# EAGLE schematic CAN shield rev1 (EAGLE 8.1.0)
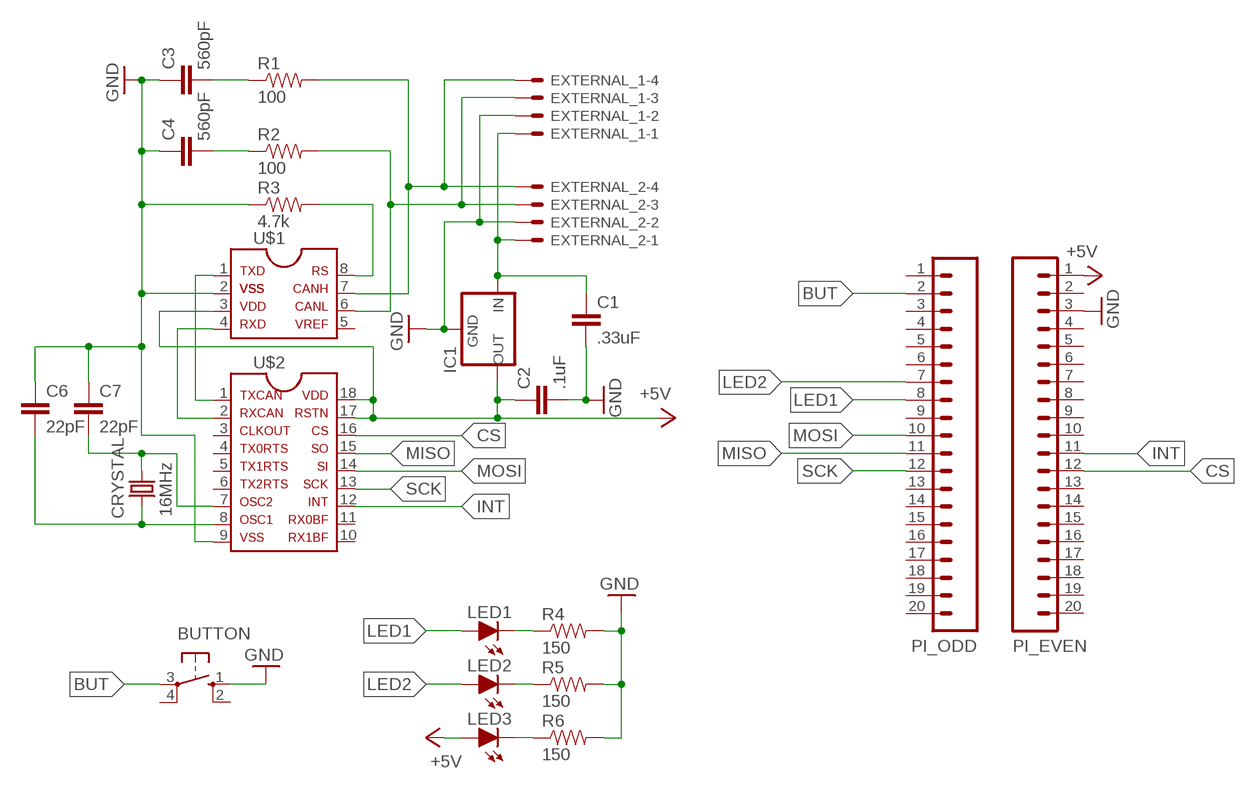
[diagram p0: schematic, sheet 1]

## Parts
BUTTON  BTN_10-XX  [B3F-10XX]
C1  .33uF  CAP0805  [0805]
C2  .1uF  CAP0805  [0805]
C3  560pF  CAP0805  [0805]
C4  560pF  CAP0805  [0805]
C6  22pF  CAP0805  [0805]
C7  22pF  CAP0805  [0805]
CRYSTAL  16MHz  CRYSTALSMD  [HC49UP]
EXTERNAL_1  MINIFIT_5566-4  [MINIFIT_5566-4]
EXTERNAL_2  MINIFIT_5566-4  [MINIFIT_5566-4]
IC1  5VREG_L7805_HOR  [TO-220-H]
LED1  LED-0805  [LED-805]
LED2  LED-0805  [LED-805]
LED3  LED-0805  [LED-805]
PI_EVEN  M20  [1X20]
PI_ODD  M20  [1X20]
R1  100  RESISTOR0805-RES  [0805]
R2  100  RESISTOR0805-RES  [0805]
R3  4.7k  RESISTOR0805-RES  [0805]
R4  150  RESISTOR0805-RES  [0805]
R5  150  RESISTOR0805-RES  [0805]
R6  150  RESISTOR0805-RES  [0805]
U$1  MCP2551  [SOIC-08]
U$2  MCP2515SMD  [SOIC-18W]

## Nets
+5V: C2.1 IC1.3(OUT) LED3.A PI_EVEN.1 U$1.3 U$2.17 U$2.18
BUT: BUTTON.3(P) PI_ODD.2
CAN-H: EXTERNAL_1.4 EXTERNAL_2.4 R1.2 U$1.7
CAN-L: EXTERNAL_1.3 EXTERNAL_2.3 R2.2 U$1.6
CS: PI_EVEN.12 U$2.16
GND: BUTTON.1(S) C1.2 C2.2 C3.1 C4.1 C6.1 C7.1 EXTERNAL_1.2 EXTERNAL_2.2 IC1.2(GND) PI_EVEN.3 R3.1 R4.2 R5.2 R6.2 U$1.2 U$2.9
INT: PI_EVEN.11 U$2.12
LED1: LED1.A PI_ODD.8
LED2: LED2.A PI_ODD.7
MISO: PI_ODD.11 U$2.15
MOSI: PI_ODD.10 U$2.14
N$1: LED1.C R4.1
N$2: LED2.C R5.1
N$5: C1.1 EXTERNAL_1.1 EXTERNAL_2.1 IC1.1(IN)
N$7: LED3.C R6.1
N$11: C6.2 CRYSTAL.2 U$2.8
N$12: U$1.1 U$2.1
N$13: U$1.4 U$2.2
N$14: C3.2 R1.1
N$15: C7.2 CRYSTAL.1 U$2.7
N$16: R3.2 U$1.8
N$17: C4.2 R2.1
SCK: PI_ODD.12 U$2.13
Unconnected: BUTTON.2(S1) BUTTON.4(P1) PI_EVEN.2 PI_EVEN.4 PI_EVEN.5 PI_EVEN.6 PI_EVEN.7 PI_EVEN.8 PI_EVEN.9 PI_EVEN.10 PI_EVEN.13 PI_EVEN.14 PI_EVEN.15 PI_EVEN.16 PI_EVEN.17 PI_EVEN.18 PI_EVEN.19 PI_EVEN.20 PI_ODD.1 PI_ODD.3 PI_ODD.4 PI_ODD.5 PI_ODD.6 PI_ODD.9 PI_ODD.13 PI_ODD.14 PI_ODD.15 PI_ODD.16 PI_ODD.17 PI_ODD.18 PI_ODD.19 PI_ODD.20 U$1.5 U$2.3 U$2.4 U$2.5 U$2.6 U$2.10 U$2.11

## Library data of the parts
BUTTON = HyTechDevices:BTN_10-XX: Small momentary tactile push button; MPN: B3F-1000; OC_FARNELL: 176432; OC_NEWARK: 36M3542
C1-C4 C6 C7 = HyTechDevices:CAP: Capacitor Standard 0603 ceramic capacitor, and 0.1" leaded capacitor.
CRYSTAL = SparkFun-FreqCtrl:CRYSTAL: Various standard crystals. Proven footprints.
EXTERNAL_1 EXTERNAL_2 = HyTechDevices:MINIFIT_5566-4: Mini-Fit Junior connector 4 pole Source: http://www.molex.com; OC_FARNELL: unknown; OC_NEWARK: unknown
IC1 = HyTechDevices:5VREG_L7805: Voltage Regulator Switching 5v regulator Datasheet <http://power.murata.com/data/power/oki-78sr.pdf> Standard 7805 5V regulator. IGO (Input Ground Output). Spark Fun Electronics SKU : COM-00107 Datasheet <http://www.mouser.com/ds/2/308/MC7800-D-94905.pdf>
LED1-LED3 = HyTechDevices:LED: Light Emitting Diode (LED) Source: Dangerous Prototypes Eagle Library <https://github.com/DangerousPrototypes/Eagle_Part_Library>
PI_EVEN PI_ODD = HyTechDevices:M20: 1x20 .1" header This is just like the LOCK variant in that the holes are staggared by 5 mil, but except for the last two holes. They are not altered from the "standard" footprint layout. This is used for a special purpose on the layout of our Graphic LCD Backpack. Make sure you want to use this device before selecting it for you project! Source: Sparkfun <https://github.com/sparkfun/SparkFun-Eagle-Libraries>
R1-R6 = HyTechDevices:RESISTOR: Resistor Basic schematic elements and footprints for 0603, 1206, and PTH resistors.
U$1 = HyTechDevices:MCP2551: MCP2551 High-Speed CAN Transceiver Product Webpage <https://www.microchip.com/wwwproducts/en/MCP2551> Datasheet <http://ww1.microchip.com/downloads/en/DeviceDoc/21667f.pdf> This device is outdated It is replaced by MCP2561. Comparison Page <https://www.microchip.com/wwwproducts/ProductCompare/MCP2551/MCP2561> Product Webpage <https://www.microchip.com/wwwproducts/en/MCP2561> Datasheet <http://ww1.microchip.com/downloads/en/DeviceDoc/20005167C.pdf>
U$2 = HyTechDevices:MCP2515: MCP2515 CAN Controller with SPI Interface Datasheet <http://ww1.microchip.com/downloads/en/DeviceDoc/21801G.pdf>